# Altium schematic sheet ESP32.SchDoc: ESP32
size A4
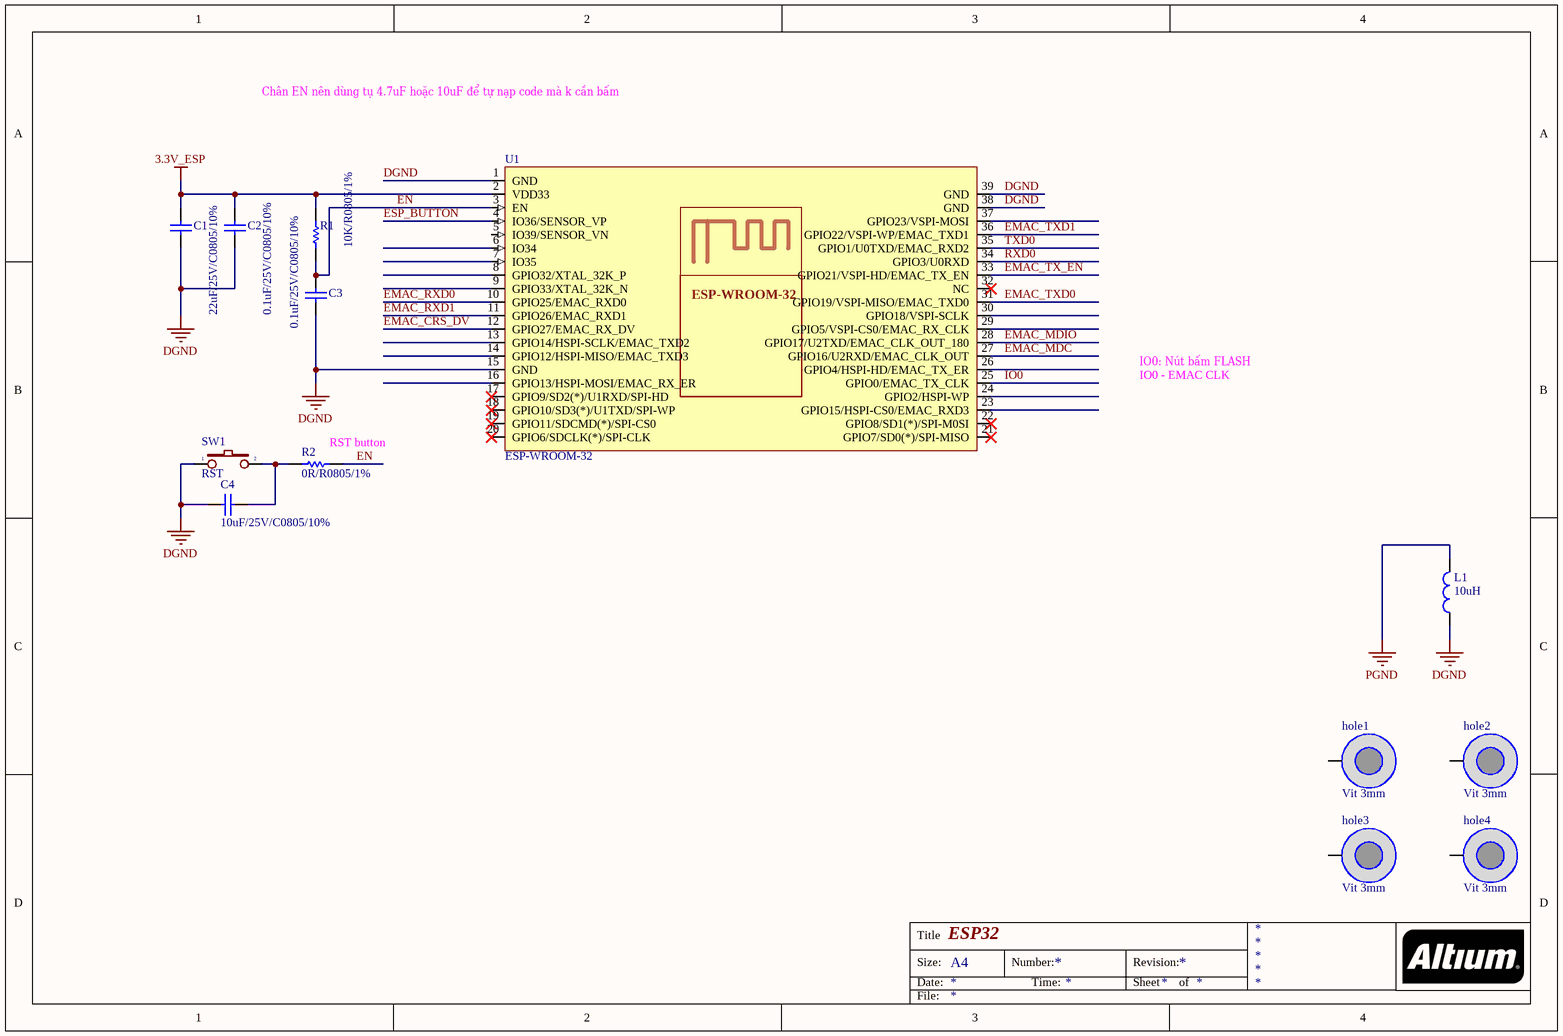
[diagram p0: ESP32.SchDoc]

## Parts
C1  22uF/25V/C0805/10%  [CAP_CERA_C2012(CC0805INCH)]
C2  0.1uF/25V/C0805/10%  [CAP_CERA_C2012(CC0805INCH)]
C3  0.1uF/25V/C0805/10%  [CAP_CERA_C2012(CC0805INCH)]
C4  10uF/25V/C0805/10%  [CAP_CERA_C2012(CC0805INCH)]
hole1  Vit 3mm  [Screw 3.0]
hole2  Vit 3mm  [Screw 3.0]
hole3  Vit 3mm  [Screw 3.0]
hole4  Vit 3mm  [Screw 3.0]
L1  10uH  [L/0.4]
R1  10K/R0805/1%  [Res 0805 SMD]
R2  0R/R0805/1%  [Res 0805 SMD]
SW1  RST  [Button 3x4mm]
U1  ESP-WROOM-32  [ESP32 WROOM]

## Nets
3.3V_ESP: C1.2 C2.2 R1.1 U1.2(VDD33)
DGND: C1.1 C2.1 C3.1 C4.2 L1.1 SW1.1 U1.1(GND) U1.15(GND) U1.38(GND) U1.39(GND)
PGND: L1.2
EMAC_CRS_DV: U1.12(GPIO27/EMAC_RX_DV)
EMAC_MDC: U1.27(GPIO16/U2RXD/EMAC_CLK_OUT)
EMAC_MDIO: U1.28(GPIO17/U2TXD/EMAC_CLK_OUT_180)
EMAC_RXD0: U1.10(GPIO25/EMAC_RXD0)
EMAC_RXD1: U1.11(GPIO26/EMAC_RXD1)
EMAC_TX_EN: U1.33(GPIO21/VSPI-HD/EMAC_TX_EN)
EMAC_TXD0: U1.31(GPIO19/VSPI-MISO/EMAC_TXD0)
EMAC_TXD1: U1.36(GPIO22/VSPI-WP/EMAC_TXD1)
EN: C3.2 R1.2 R2.2 U1.3(EN)
ESP_BUTTON: U1.4(IO36/SENSOR_VP)
IO0: U1.25(GPIO0/EMAC_TX_CLK)
RXD0: U1.34(GPIO3/U0RXD)
TXD0: U1.35(GPIO1/U0TXD/EMAC_RXD2)
NetC4_1: C4.1 R2.1 SW1.2

Not connected (* = marked no-connect by the designer): hole1 1(hole); hole2 1(hole); hole3 1(hole); hole4 1(hole); U1 5(IO39/SENSOR_VN) 6(IO34) 7(IO35) 8(GPIO32/XTAL_32K_P) 9(GPIO33/XTAL_32K_N) 13(GPIO14/HSPI-SCLK/EMAC_TXD2) 14(GPIO12/HSPI-MISO/EMAC_TXD3) 16(GPIO13/HSPI-MOSI/EMAC_RX_ER) 17(GPIO9/SD2(*)/U1RXD/SPI-HD)* 18(GPIO10/SD3(*)/U1TXD/SPI-WP)* 19(GPIO11/SDCMD(*)/SPI-CS0)* 20(GPIO6/SDCLK(*)/SPI-CLK)* 21(GPIO7/SD0(*)/SPI-MISO)* 22(GPIO8/SD1(*)/SPI-M0SI)* 23(GPIO15/HSPI-CS0/EMAC_RXD3) 24(GPIO2/HSPI-WP) 26(GPIO4/HSPI-HD/EMAC_TX_ER) 29(GPIO5/VSPI-CS0/EMAC_RX_CLK) 30(GPIO18/VSPI-SCLK) 32(NC)* 37(GPIO23/VSPI-MOSI)

## Notes on the sheet
- Chân EN nên dùng tụ 4.7uF hoặc 10uF để tự nạp code mà k cần bấm
- IO0: Nút bấm FLASH
- IO0 - EMAC CLK
- (near R2) RST button
- Title
- Size:
- Date:
- A4
- Number:
- Time:
- Revision:
- Sheet
- of
- File:

## Library data of the parts
C1 = 0.1uF/50V/C0603/10%: 22µF ±20% 25V Ceramic Capacitor X5R 0805 (2012 Metric); Manufacturer: Tariff Applied; ComponentLink1URL: http://www.murata.com/~/media/webrenewal/support/library/catalog/products/capacitor/mlcc/c02e.ashx; ComponentLink1Description: http://www.murata.com/~/media/webrenewal/support/library/catalog/products/capacitor/mlcc/c02e.ashx; Digikey: 1276-2908-1-ND
C2-C4 = 0.1uF/50V/C0603/10%: 0.1µF ±10% 25V Ceramic Capacitor X7R 0805 (2012 Metric); ComponentLink1URL: http://www.murata.com/~/media/webrenewal/support/library/catalog/products/capacitor/mlcc/c02e.ashx; ComponentLink1Description: http://www.murata.com/~/media/webrenewal/support/library/catalog/products/capacitor/mlcc/c02e.ashx; Digikey: 478-3755-1-ND
L1 = L1: Inductor; Value: 150 mH
R1 = 200K/R0603/1%: 10 kOhms ±1% 0.125W, 1/8W Chip Resistor 0805 (2012 Metric) Thick Film; Power (Watts): 0.1W, 1/10W; RoHS: RoHS Compliant; Category: Resistors; Part Status: Active; Features: Moisture Resistant; Operating Temperature: -55°C ~ 155°C; Package / Case: 0603 (1608 Metric); Supplier Device Package: 0603; Size / Dimension: 0.063" L x 0.031" W (1.60mm x 0.80mm); Height - Seated (Max): 0.022" (0.55mm); Failure Rate: -; ComponentLink1URL: http://www.yageo.com/documents/recent/PYu-RC_Group_51_RoHS_L_7.pdf; ComponentLink1Description: http://www.yageo.com/documents/recent/PYu-RC_Group_51_RoHS_L_7.pdf; Digikey: A126332CT-ND
R2 = 200K/R0603/1%: 0 Ohms Jumper 0.125W, 1/8W Chip Resistor 0805 (2012 Metric) Automotive AEC-Q200 Thick Film; Part Status: Active; Height - Seated (Max): 0.022" (0.55mm); Failure Rate: -; ComponentLink1URL: http://www.yageo.com/documents/recent/PYu-RC_Group_51_RoHS_L_7.pdf; ComponentLink1Description: http://www.yageo.com/documents/recent/PYu-RC_Group_51_RoHS_L_7.pdf; Digikey: 541-0.0ACT-ND
SW1 = SW2: SWITCH TACTILE SPST-NO 0.05A 12V; Digikey: CKN10384CT-ND
U1 = ESP-WROOM-32: ESP-WROOM-32 (8MB), WIFI MODULE 64 MBITS SPI FLASH; Digikey: 1904-1019-1-ND